# Altium schematic sheet peripherals.SchDoc
size A3
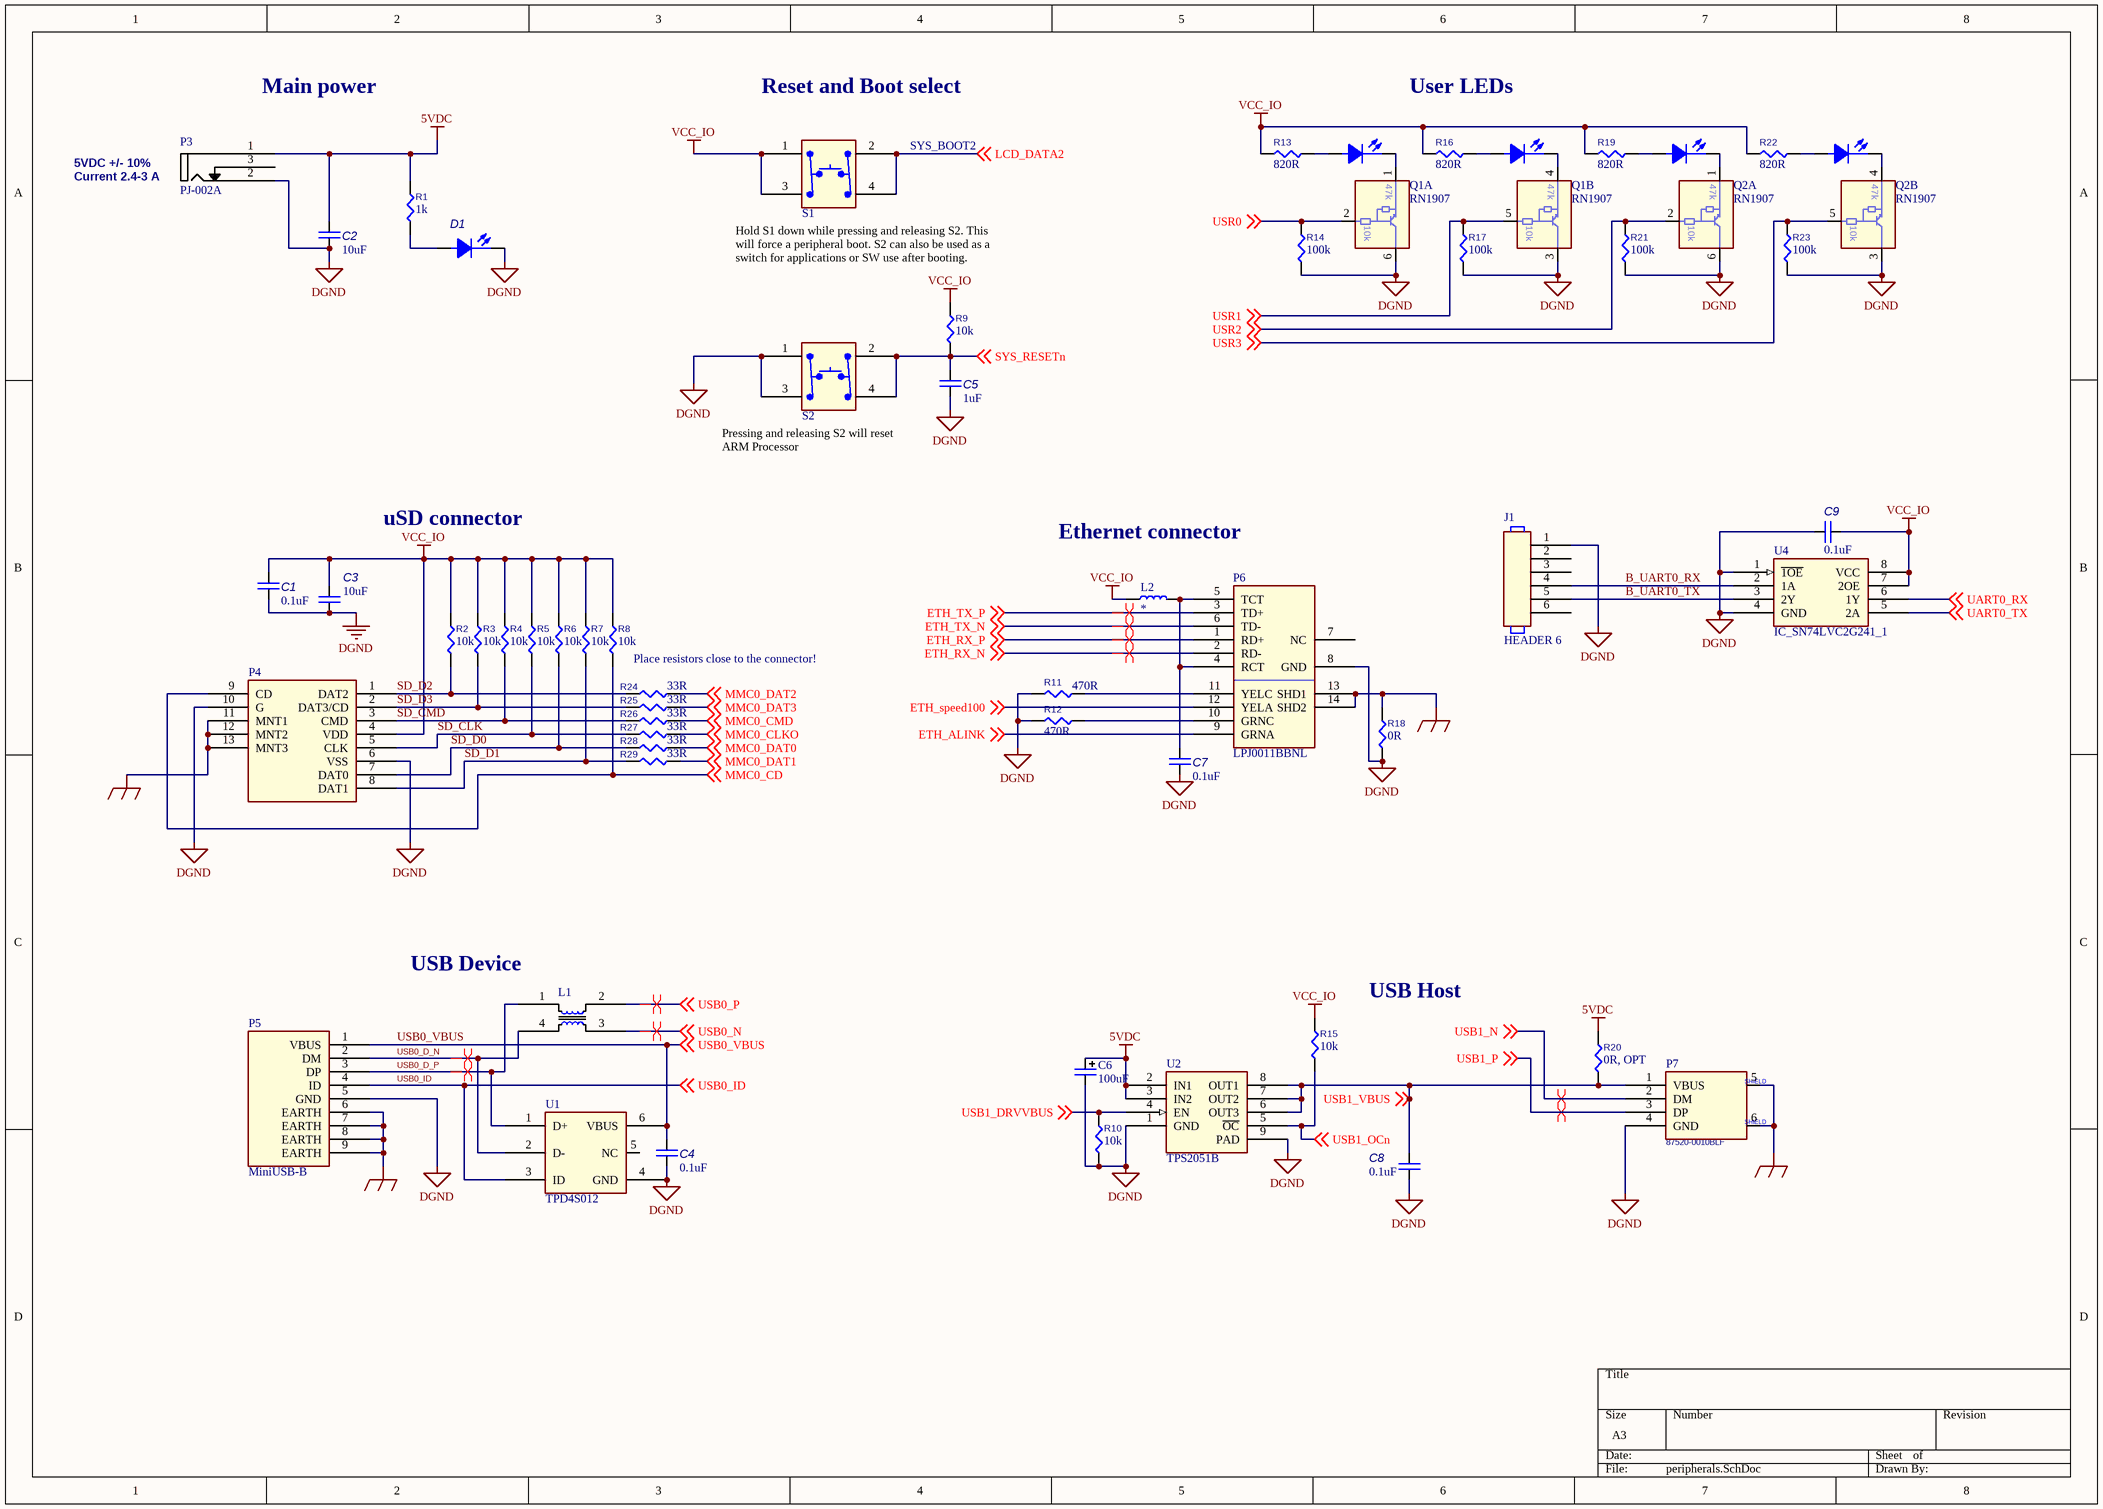
[diagram p0: peripherals.SchDoc]

## Parts
C1  value 0.1uF  [CC1608-0603]  (hidden comment: C0603)
C2  value 10uF  [CC2012-0805]  (hidden comment: C0805)
C3  value 10uF  [CC2012-0805]  (hidden comment: C0805)
C4  value 0.1uF  [CC1608-0603]  (hidden comment: C0603)
C5  value 1uF  [CC1608-0603]  (hidden comment: C0603)
C6  value 100uF  [Cap_C]  (hidden comment: Cap_C)
C7  value 0.1uF  [CC1608-0603]  (hidden comment: C0603)
C8  value 0.1uF  [CC1608-0603]  (hidden comment: C0603)
C9  value 0.1uF  [CC1608-0603]  (hidden comment: C0603)
D1  LED0805  [LED0805]  (value not drawn)
D2  LED0805  [LED0805]  (value not drawn)
D3  LED0805  [LED0805]  (value not drawn)
D4  LED0805  [LED0805]  (value not drawn)
D5  LED0805  [LED0805]  (value not drawn)
J1  HEADER 6  [DIP6]
L1  DLW21H  [DLW21H]  (value not drawn)
L2  BLM18A-FB  [CHIP0603]  (value not drawn)
P3  PJ-002A  [PJ-002A]
P4  (no value)  [TFC08WP01F-A-R1K-H]
P5  MiniUSB-B  [MINI-USB-B5 SMT]
P6  P/N: LPJ0011BBNL  [TRJ0011ABNL]  (hidden comment: CONN_RJ45_MAG_WE_0)
P7  P/N: 87520-0010BLF  [USB2.5-2H4C]  (hidden comment: CONN_54819-0578_2)
Q1  RN1907  [SOT363-6L]  (parts A,B of 2)
Q2  RN1907  [SOT363-6L]  (parts A,B of 2)
R1  value 1k  [RESC1608X55N]  (hidden comment: R0603)
R2  value 10k  [RESC1608X55N]  (hidden comment: R0603)
R3  value 10k  [RESC1608X55N]  (hidden comment: R0603)
R4  value 10k  [RESC1608X55N]  (hidden comment: R0603)
R5  value 10k  [RESC1608X55N]  (hidden comment: R0603)
R6  value 10k  [RESC1608X55N]  (hidden comment: R0603)
R7  value 10k  [RESC1608X55N]  (hidden comment: R0603)
R8  value 10k  [RESC1608X55N]  (hidden comment: R0603)
R9  value 10k  [RESC1608X55N]  (hidden comment: R0603)
R10  value 10k  [RESC1608X55N]  (hidden comment: R0603)
R11  value 470R  [RESC1608X55N]  (hidden comment: R0603)
R12  value 470R  [RESC1608X55N]  (hidden comment: R0603)
R13  value 820R  [RESC1608X55N]  (hidden comment: R0603)
R14  value 100k  [RESC1608X55N]  (hidden comment: R0603)
R15  value 10k  [RESC1608X55N]  (hidden comment: R0603)
R16  value 820R  [RESC1608X55N]  (hidden comment: R0603)
R17  value 100k  [RESC1608X55N]  (hidden comment: R0603)
R18  value 0R  [RESC1608X55N]  (hidden comment: R0603)
R19  value 820R  [RESC1608X55N]  (hidden comment: R0603)
R20  value 0R, OPT  [RESC1608X55N]  (hidden comment: R0603)
R21  value 100k  [RESC1608X55N]  (hidden comment: R0603)
R22  value 820R  [RESC1608X55N]  (hidden comment: R0603)
R23  value 100k  [RESC1608X55N]  (hidden comment: R0603)
R24  value 33R  [RESC1608X55N]  (hidden comment: R0603)
R25  value 33R  [RESC1608X55N]  (hidden comment: R0603)
R26  value 33R  [RESC1608X55N]  (hidden comment: R0603)
R27  value 33R  [RESC1608X55N]  (hidden comment: R0603)
R28  value 33R  [RESC1608X55N]  (hidden comment: R0603)
R29  value 33R  [RESC1608X55N]  (hidden comment: R0603)
S1  SW_KT11P2JM_2  [KMR231GLFS]  (value not drawn)
S2  SW_KT11P2JM_2  [KMR231GLFS]  (value not drawn)
U1  TPD4S012  [s-puson-n6]
U2  TPS2051B  [R-PDSO-G8]
U4  IC_SN74LVC2G241_1  [SOP127P600-8N]

## Nets
5VDC: C2.2 C6.1 P3.1(GND) R1.2 R20.2 U2.2(IN1) U2.3(IN2)
DGND: C1.2 C2.1 C3.1 C4.2 C5.2 C6.2 C7.2 C8.1 C9.1 D1.2(C) J1.1 P3.2(RIGHT) P4.6(VSS) P4.10(G) P5.5(GND) P6.8(GND) P7.4(GND) Q1.3 Q1.6 Q2.3 Q2.6 R10.1 R11.1 R12.1 R14.1 R17.1 R18.1 R21.1 R23.1 S2.1(A1) S2.3(A2) U1.4(GND) U2.1(GND) U2.9(PAD) U4.1(~{1OE}) U4.4(GND)
EARTH: P4.11(MNT1) P4.12(MNT2) P4.13(MNT3) P5.6(EARTH) P5.7(EARTH) P5.8(EARTH) P5.9(EARTH) P6.13(SHD1) P6.14(SHD2) P7.5(SHELD1) P7.6(PAD4) R18.2
VCC_IO: C1.1 C3.2 C9.2 L2.1 P4.4(VDD) R2.2 R3.2 R4.2 R5.2 R6.2 R7.2 R8.2 R9.2 R13.2 R15.2 R16.2 R19.2 R22.2 S1.1(A1) S1.3(A2) U4.7(2OE) U4.8(VCC)
B_UART0_RX: J1.4 U4.2(1A)
B_UART0_TX: J1.5 U4.3(2Y)
ETH_ALINK: P6.9(GRNA) ; off-sheet ETH_ALINK
ETH_RX_N: P6.2(RD-) ; off-sheet ETH_RX_N
ETH_RX_P: P6.1(RD+) ; off-sheet ETH_RX_P
ETH_speed100: P6.12(YELA) ; off-sheet ETH_speed100
ETH_TX_N: P6.6(TD-) ; off-sheet ETH_TX_N
ETH_TX_P: P6.3(TD+) ; off-sheet ETH_TX_P
LCD_DATA2: S1.2(B1) S1.4(B2) ; off-sheet LCD_DATA2
MMC0_CD: P4.9(CD) R8.1 ; off-sheet MMC0_CD
MMC0_CLKO: R27.2 ; off-sheet MMC0_CLKO
MMC0_CMD: R26.2 ; off-sheet MMC0_CMD
MMC0_DAT0: R28.2 ; off-sheet MMC0_DAT0
MMC0_DAT1: R29.2 ; off-sheet MMC0_DAT1
MMC0_DAT2: R24.2 ; off-sheet MMC0_DAT2
MMC0_DAT3: R25.2 ; off-sheet MMC0_DAT3
SD_CLK: P4.5(CLK) R5.1 R27.1
SD_CMD: P4.3(CMD) R4.1 R26.1
SD_D0: P4.7(DAT0) R6.1 R28.1
SD_D1: P4.8(DAT1) R7.1 R29.1
SD_D2: P4.1(DAT2) R2.1 R24.1
SD_D3: P4.2(DAT3/CD) R3.1 R25.1
SYS_RESETn: C5.1 R9.1 S2.2(B1) S2.4(B2) ; off-sheet SYS_RESETn
UART0_RX: U4.6(1Y) ; off-sheet UART0_RX
UART0_TX: U4.5(2A) ; off-sheet UART0_TX
USB0_D_N: L1.4 P5.2(DM) U1.2(D-)
USB0_D_P: L1.1 P5.3(DP) U1.1(D+)
USB0_ID: P5.4(ID) U1.3(ID) ; off-sheet USB0_ID
USB0_N: L1.3 ; off-sheet USB0_N
USB0_P: L1.2 ; off-sheet USB0_P
USB0_VBUS: C4.1 P5.1(VBUS) U1.6(VBUS) ; off-sheet USB0_VBUS
USB1_DRVVBUS: R10.2 U2.4(EN) ; off-sheet USB1_DRVVBUS
USB1_N: P7.2(DM) ; off-sheet USB1_N
USB1_OCn: R15.1 U2.5(~{OC}) ; off-sheet USB1_OCn
USB1_P: P7.3(DP) ; off-sheet USB1_P
USB1_VBUS: C8.2 P7.1(VBUS) R20.1 U2.6(OUT3) U2.7(OUT2) U2.8(OUT1) ; off-sheet USB1_VBUS
USR0: Q1.2 R14.2 ; off-sheet USR0
USR1: Q1.5 R17.2 ; off-sheet USR1
USR2: Q2.2 R21.2 ; off-sheet USR2
USR3: Q2.5 R23.2 ; off-sheet USR3
NetC7_1: C7.1 L2.2 P6.4(RCT) P6.5(TCT)
NetD1_1: D1.1(A) R1.1
NetD2_1: D2.1(A) R13.1
NetD2_2: D2.2(C) Q1.1
NetD3_1: D3.1(A) R16.1
NetD3_2: D3.2(C) Q1.4
NetD4_1: D4.1(A) R19.1
NetD4_2: D4.2(C) Q2.1
NetD5_1: D5.1(A) R22.1
NetD5_2: D5.2(C) Q2.4
NetP6_10: P6.10(GRNC) R12.2
NetP6_11: P6.11(YELC) R11.2

Not connected (* = marked no-connect by the designer): J1 2 3 6; P3 3(LEFT); P6 7(NC); U1 5(NC)

## Layout directives
differential pair: ETH_RX_N, ETH_RX_P, ETH_TX_N, ETH_TX_P, USB0_D_N, USB0_D_P, USB0_N, USB0_P, USB1_N, USB1_P

## Notes on the sheet
- Main power
- Reset and Boot select
- User LEDs
- SYS_BOOT2
- 5VDC +/- 10%
  Current 2.4-3 A
- Hold S1 down while pressing and releasing S2. This
  will force a peripheral boot. S2 can also be used as a
  switch for applications or SW use after booting.
- (near S2) Pressing and releasing S2 will reset ARM Processor
- uSD connector
- Ethernet connector
- Place resistors close to the connector!
- (near L1) USB Device
- USB Host
- (in symbol CONN_54819-0578_2) SHIELD
- (in symbol RN1907, part A) 47k; 10k
- (in symbol RN1907, part B) 47k; 10k

## Library data of the parts
C6 = Cap_C: Tantalum Capacitor Case C; P/N: *
D1-D5 = LED0805: LED 0805; Value: *
J1 = HEADER 6: CONN HEADER 6POS, VERTICAL,  .100 STR TIN; Mfr: FCI; P/N: 68000-406HLF
L1 = DLW21H: Low profile wire-wound common choke coil; Manufacturer: Murata; Man P/N: DLW21HN900SQ2
L2 = BLM18A-FB: Chip EMIFILr Inductor Type; Manufacturer: Murata; Man P/N: *
P3 = PJ-002A: DC POWER JACK; Manufacturer: CIU Inc; Vendor: Digi-key; Alternative P/N: DJK-02A; Man P/N: PJ-002A
P4 = TFC08WP01F-R1K-H-CN: Connector for microSD™ Card (Push-push Type); Mfr: AUK Contractors Co, LTD; P/N: TFC08WP01F-R1K-H-CN
P5 = MiniUSB-B: Mini USB Type B CONNECTOR; Mfr: Hirose; P/N: UX60SC-MB-5ST(80)
P6 = CONN_RJ45_MAG_WE_0: RJ-45 10/100 W/Magnetics; Mfr: Link PP; P/N-2: Wurth 7499011212
P7 = CONN_54819-0578_2: USB Type A Connectors; Mfr: FCI
Q1 Q2 = RN1907: Transistor Silicon NPN; Mfr: Panasonic; P/N: DMC564040R
S1 S2 = SW_KT11P2JM_2: SMD button; Mfr: C&K Components; P/N: KMR231GLFS
U1 = TPD4S012: 4-Channel USB ESD Solution with Power Clamp; Mfr: TI; P/N: TPD4S012DRYR
U2 = TPS2051B: CURRENT-LIMITED, POWER-DISTRIBUTION SWITCHES; Mfr: TI; P/N: TPS2051BDGN
U4 = IC_SN74LVC2G241_1: Dual Buffer/Driver With 3-State Outputs; Mfr: TI; P/N: SN74LVC2G241DCU
C1 C4 C5 C7-C9 = C0603: P/N: *
C2 C3 = C0805: P/N: *
R1-R29 = R0603: P/N: *